# Altium schematic sheet Five cell modules.SchDoc
size A4; SheetNumber: 1; SheetTotal: 2
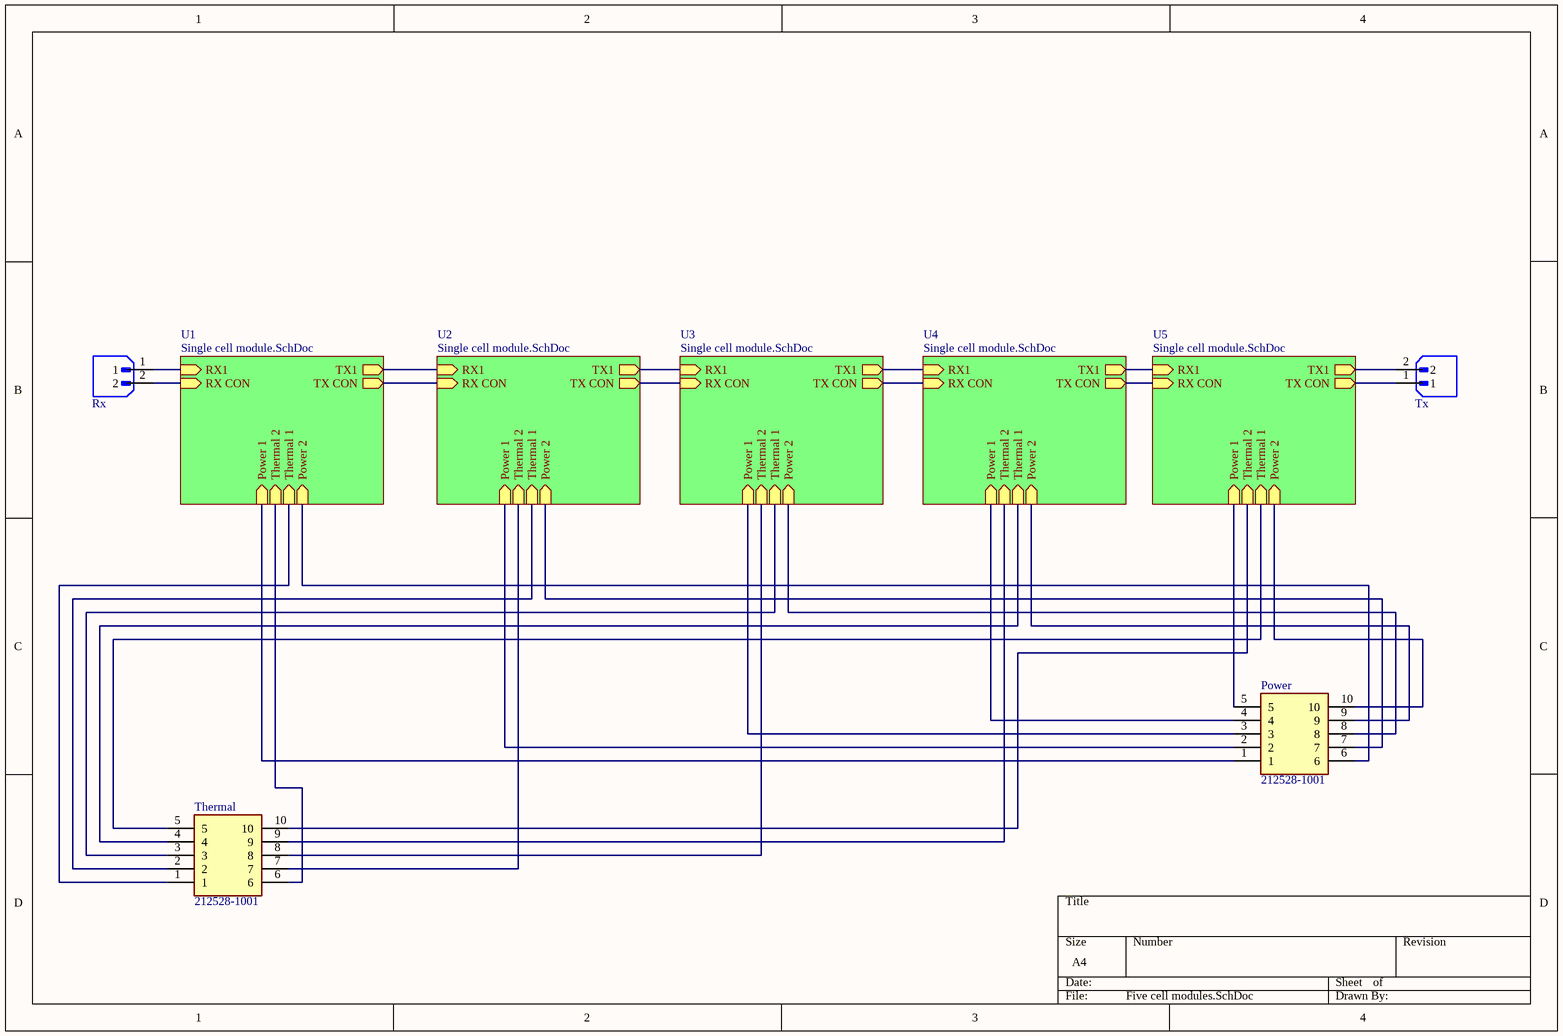
[diagram p0: Five cell modules.SchDoc]

## Parts
Power  212528-1001  [212528-10YY_1]
Rx  B2B-XH-A(LF)(SN)  [JST_B2B-XH-A(LF)(SN)]  (value not drawn)
Thermal  212528-1001  [212528-10YY_1]
Tx  B2B-XH-A(LF)(SN)  [JST_B2B-XH-A(LF)(SN)]  (value not drawn)

## Sub-sheets
U1 = Single cell module.SchDoc: TX1 (out), TX CON (out), RX1 (in), RX CON (in), Power 1 (in), Thermal 2 (in), Thermal 1 (in), Power 2 (in)
U2 = Single cell module.SchDoc: TX1 (out), TX CON (out), RX1 (in), RX CON (in), Power 1 (in), Thermal 2 (in), Thermal 1 (in), Power 2 (in)
U3 = Single cell module.SchDoc: TX1 (out), TX CON (out), RX1 (in), RX CON (in), Power 1 (in), Thermal 2 (in), Thermal 1 (in), Power 2 (in)
U4 = Single cell module.SchDoc: TX1 (out), TX CON (out), RX1 (in), RX CON (in), Power 1 (in), Thermal 2 (in), Thermal 1 (in), Power 2 (in)
U5 = Single cell module.SchDoc: TX1 (out), TX CON (out), RX1 (in), RX CON (in), Power 1 (in), Thermal 2 (in), Thermal 1 (in), Power 2 (in)

## Nets
NetPower_1: Power.1 ; sheet U1/Power 1
NetPower_2: Power.2 ; sheet U2/Power 1
NetPower_3: Power.3 ; sheet U3/Power 1
NetPower_4: Power.4 ; sheet U4/Power 1
NetPower_5: Power.5 ; sheet U5/Power 1
NetPower_6: Power.6 ; sheet U1/Power 2
NetPower_7: Power.7 ; sheet U2/Power 2
NetPower_8: Power.8 ; sheet U3/Power 2
NetPower_9: Power.9 ; sheet U4/Power 2
NetPower_10: Power.10 ; sheet U5/Power 2
NetRx_1: Rx.1 ; sheet U1/RX1
NetRx_2: Rx.2 ; sheet U1/RX CON
NetThermal_1: Thermal.1 ; sheet U1/Thermal 1
NetThermal_2: Thermal.2 ; sheet U2/Thermal 1
NetThermal_3: Thermal.3 ; sheet U3/Thermal 1
NetThermal_4: Thermal.4 ; sheet U4/Thermal 1
NetThermal_5: Thermal.5 ; sheet U5/Thermal 1
NetThermal_6: Thermal.6 ; sheet U1/Thermal 2
NetThermal_7: Thermal.7 ; sheet U2/Thermal 2
NetThermal_8: Thermal.8 ; sheet U3/Thermal 2
NetThermal_9: Thermal.9 ; sheet U4/Thermal 2
NetThermal_10: Thermal.10 ; sheet U5/Thermal 2
NetTx_1: Tx.1 ; sheet U5/TX CON
NetTx_2: Tx.2 ; sheet U5/TX1
(unnamed): sheet U3/TX1, sheet U4/RX1
(unnamed): sheet U3/TX CON, sheet U4/RX CON
(unnamed): sheet U3/RX1, sheet U2/TX1
(unnamed): sheet U3/RX CON, sheet U2/TX CON
(unnamed): sheet U4/TX1, sheet U5/RX1
(unnamed): sheet U4/TX CON, sheet U5/RX CON
(unnamed): sheet U1/TX1, sheet U2/RX1
(unnamed): sheet U1/TX CON, sheet U2/RX CON

## Library data of the parts
Power Thermal = 212528-1001: Connector; Manufacturer_Name: Molex; Datasheet Link: https://www.molex.com/pdm_docs/sd/2125280200_sd.pdf; Height: 8.8mm; Manufacturer_Part_Number: 212528-1001; Mouser Part Number: 538-212528-1001; Mouser Price/Stock: https://www.mouser.co.uk/ProductDetail/Molex/212528-1001?qs=W%2FMpXkg%252BdQ4hWZ2b%252Bpt5GQ%3D%3D
Rx Tx = B2B-XH-A(LF)(SN): Connector Header Through Hole 2 position 0.098 (2.50mm); MF: JST Sales America Inc.; SnapEDA_Link: https://www.snapeda.com/parts/B2B-XH-A(LF)(SN)/JST+Sales+America+Inc./view-part/?ref=snap; Package: None; Value: *; MP: B2B-XH-A(LF)(SN); Check_prices: https://www.snapeda.com/parts/B2B-XH-A(LF)(SN)/JST+Sales+America+Inc./view-part/?ref=eda